# EAGLE schematic avalon_module (EAGLE 6.2)
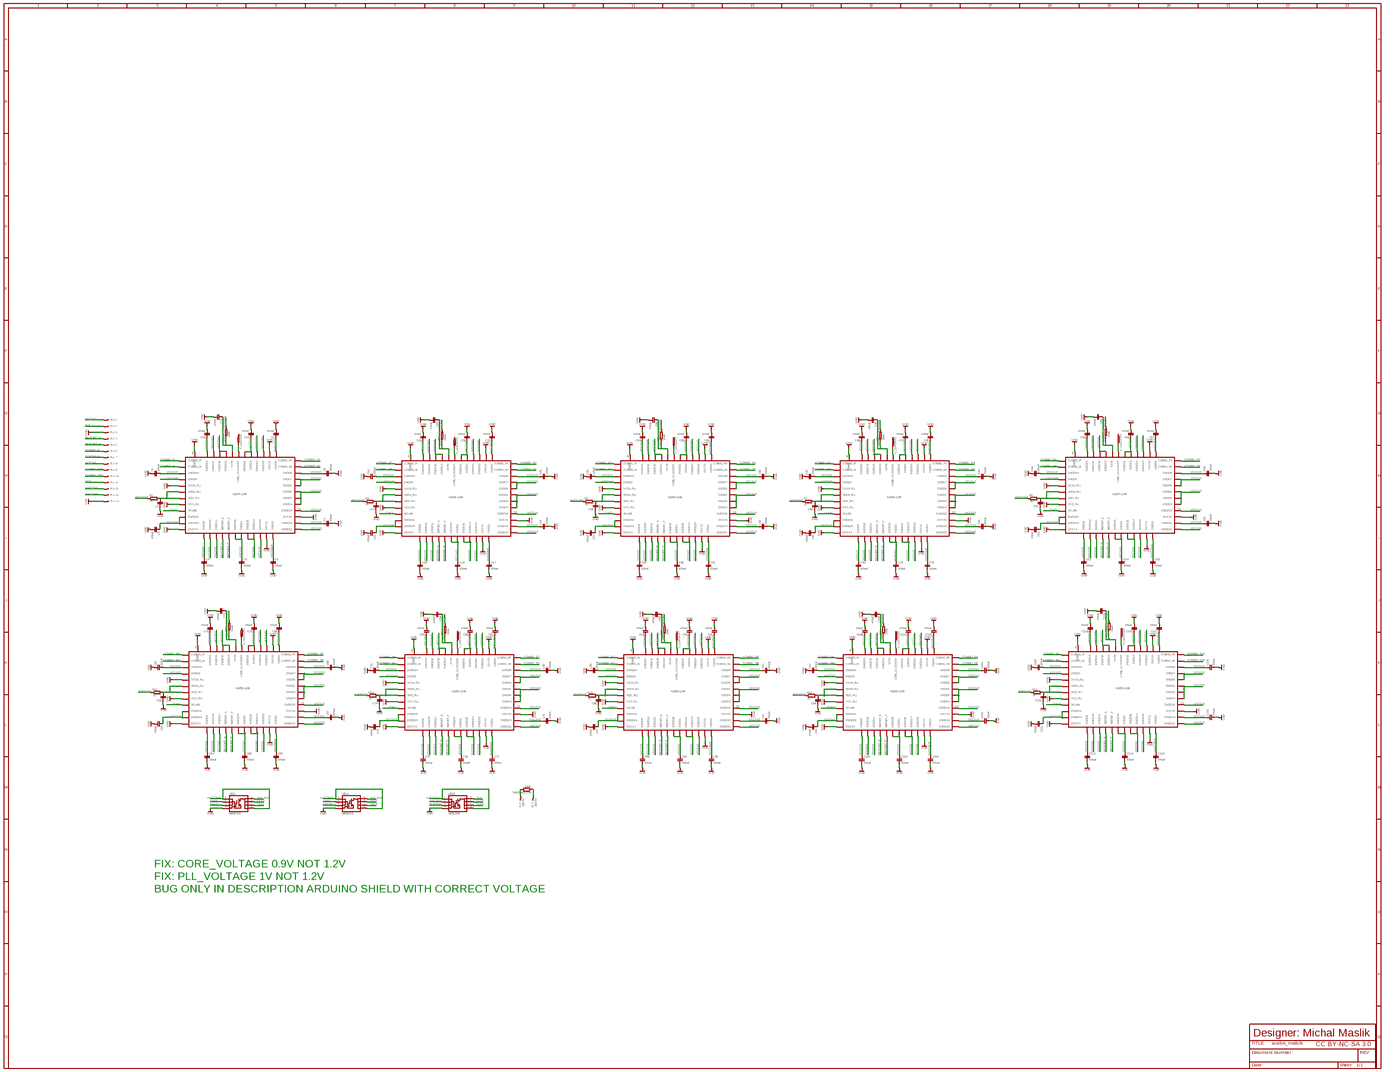
[diagram p0: schematic, sheet 1, overview]
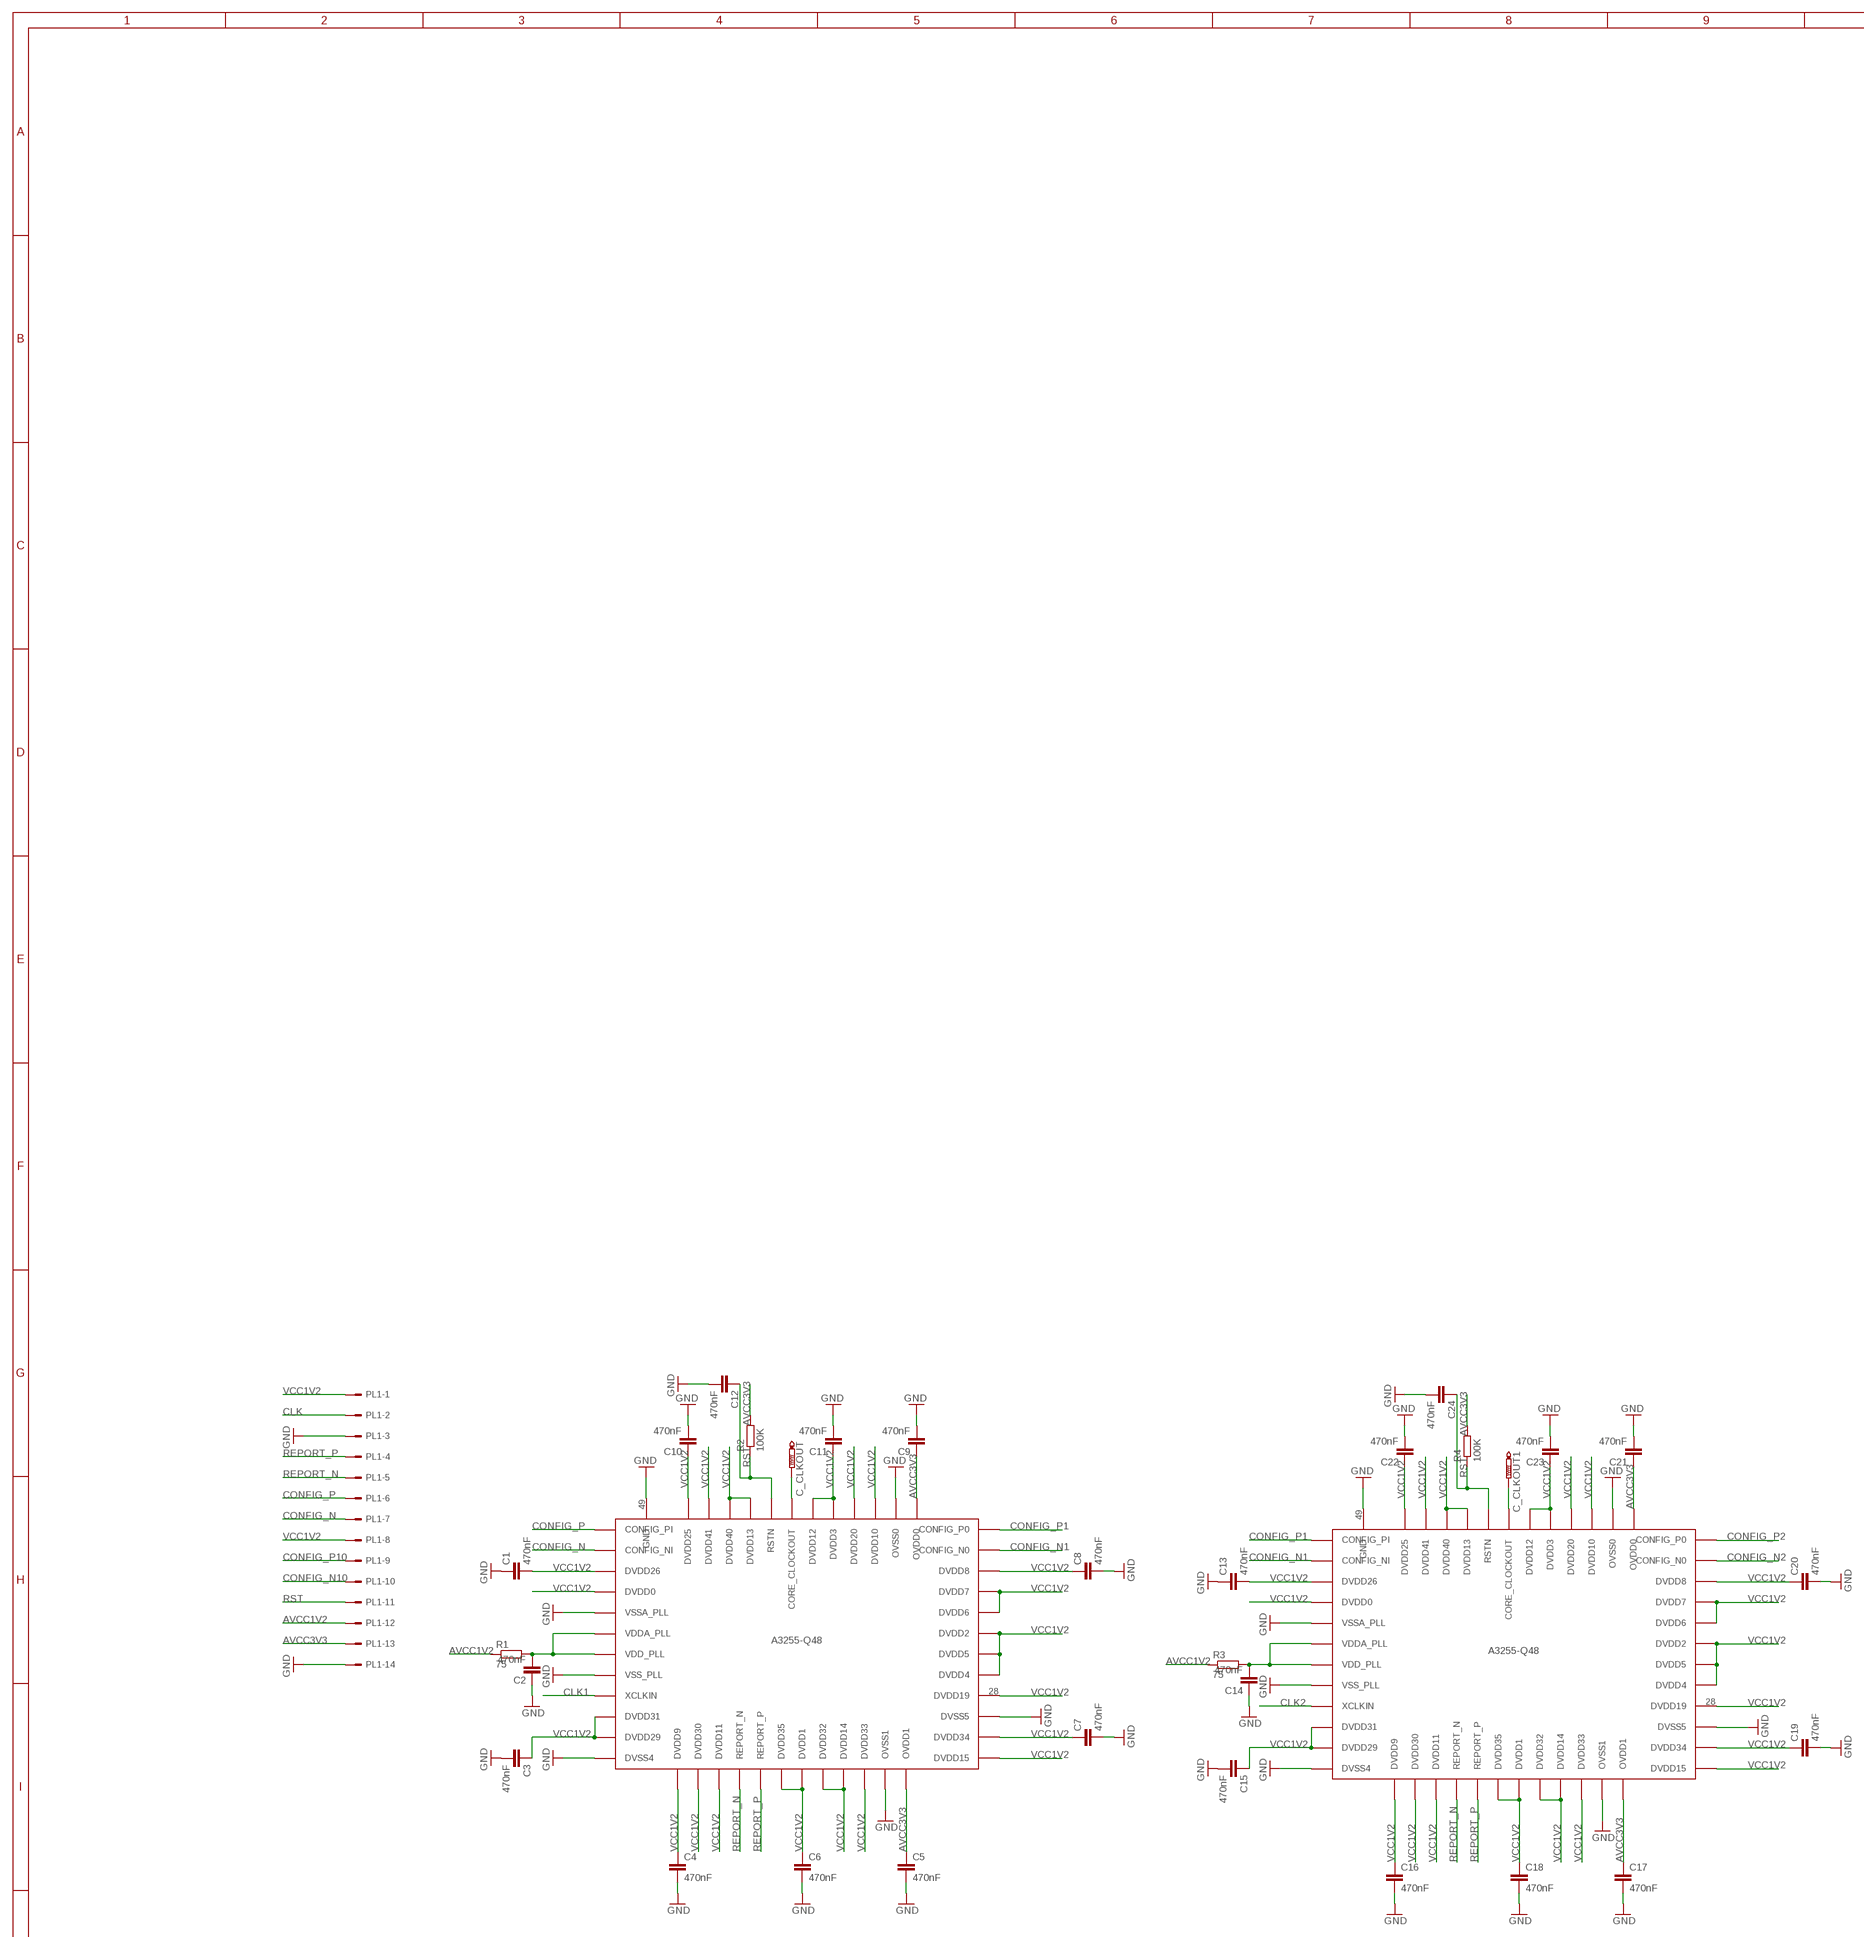
[diagram p1: schematic, sheet 1, part 1 of 6]
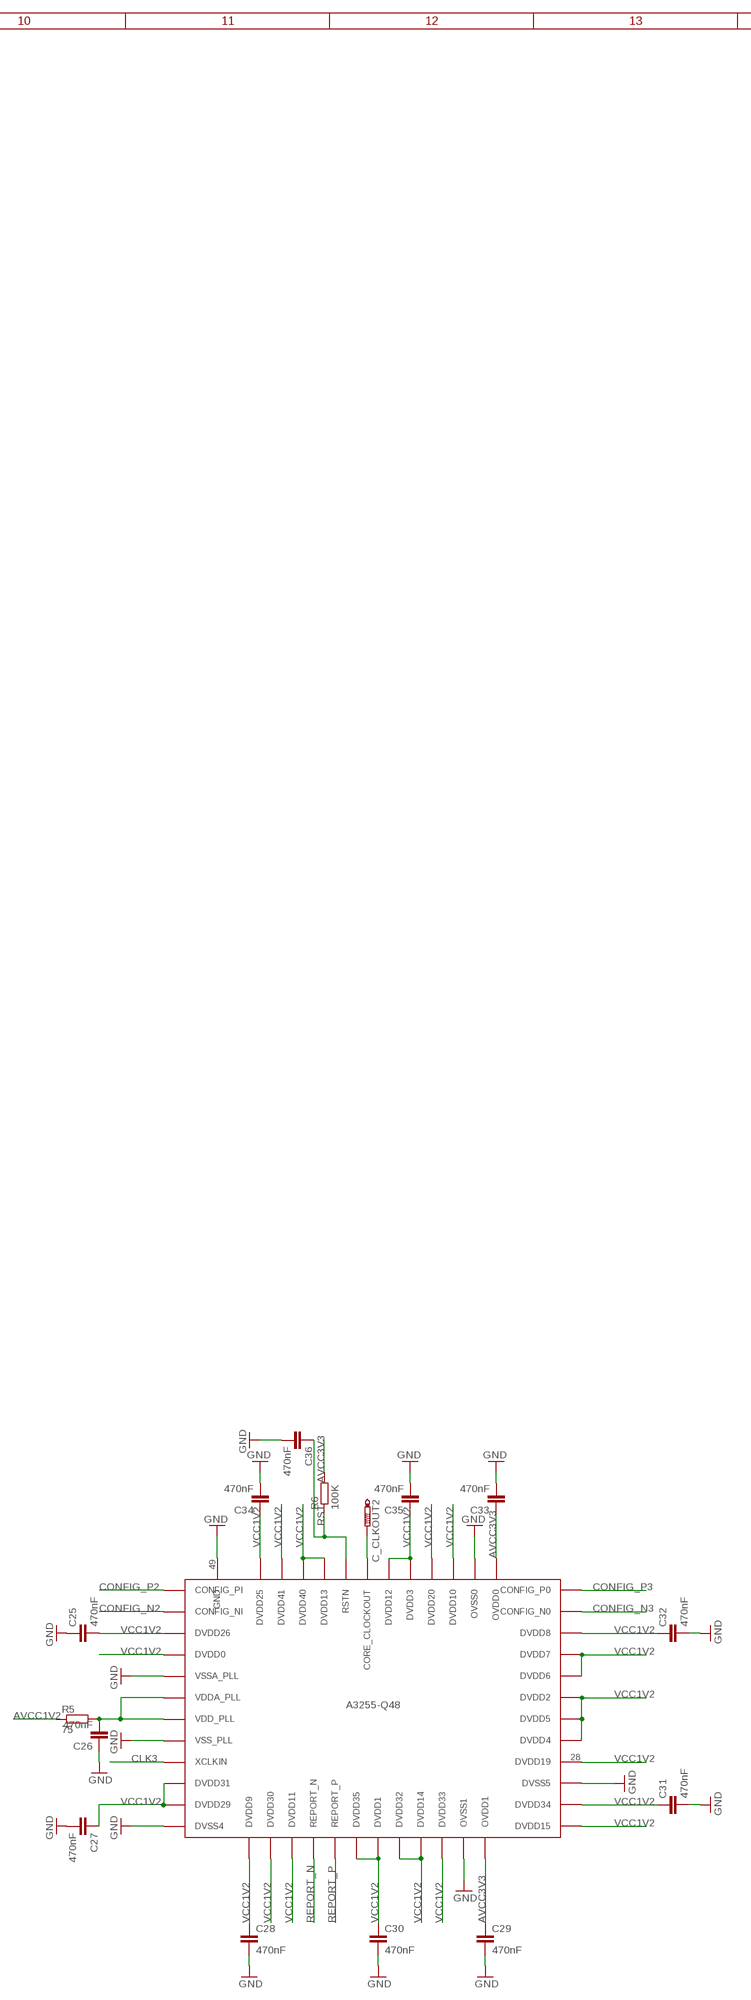
[diagram p2: schematic, sheet 1, part 2 of 6]
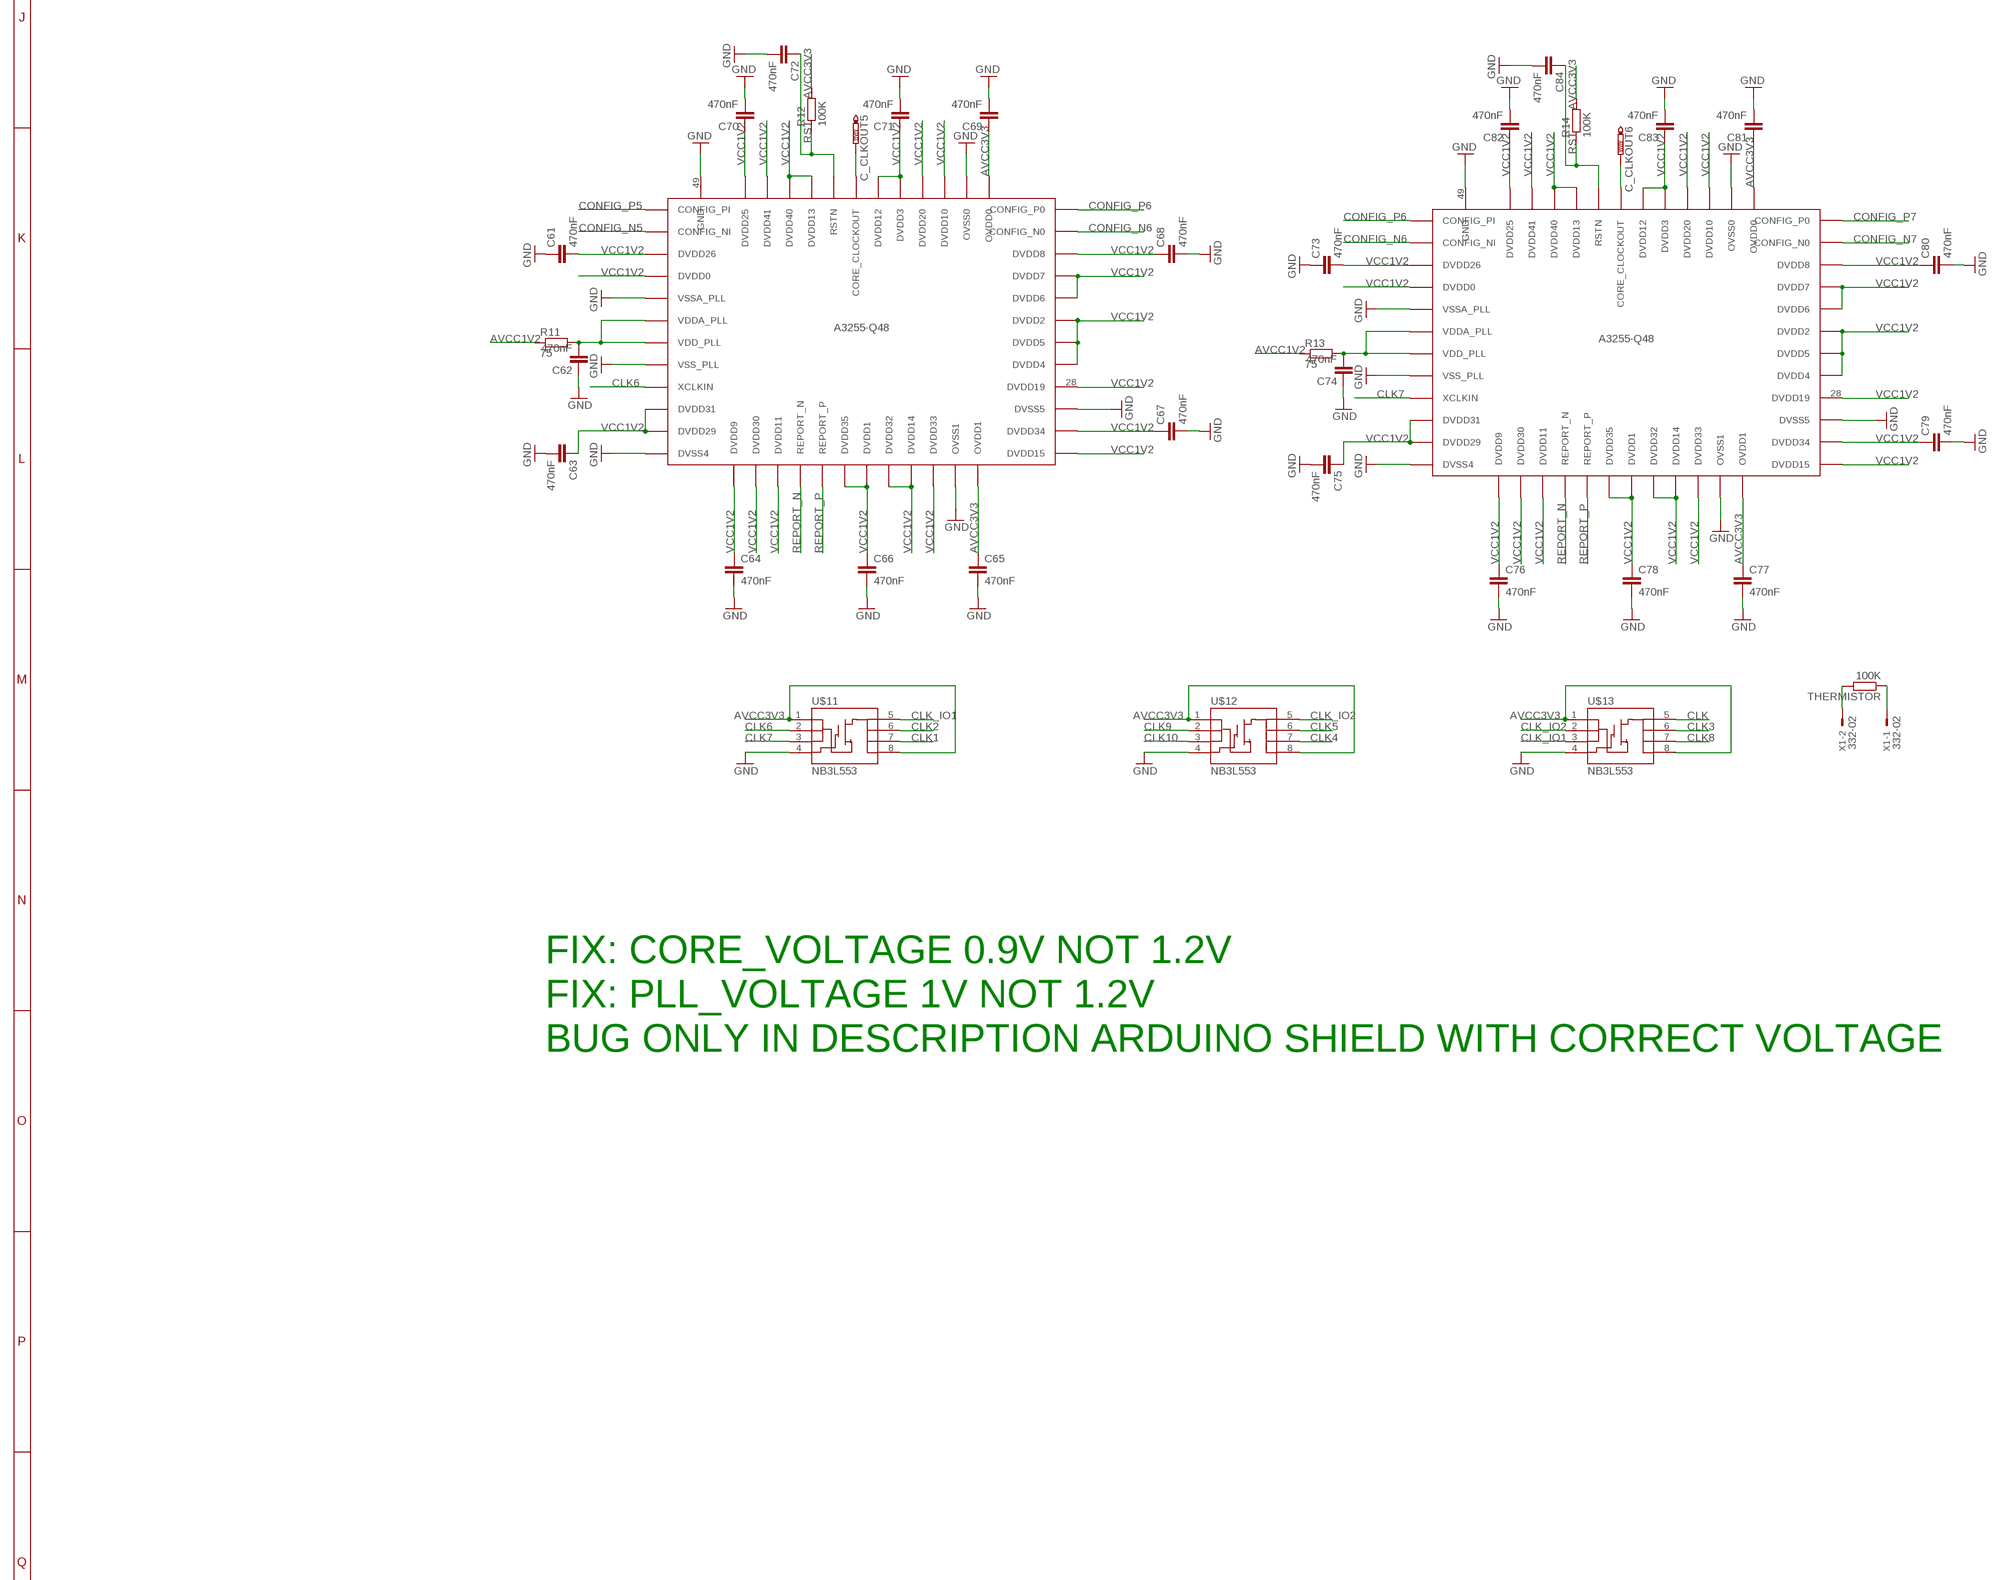
[diagram p3: schematic, sheet 1, part 3 of 6]
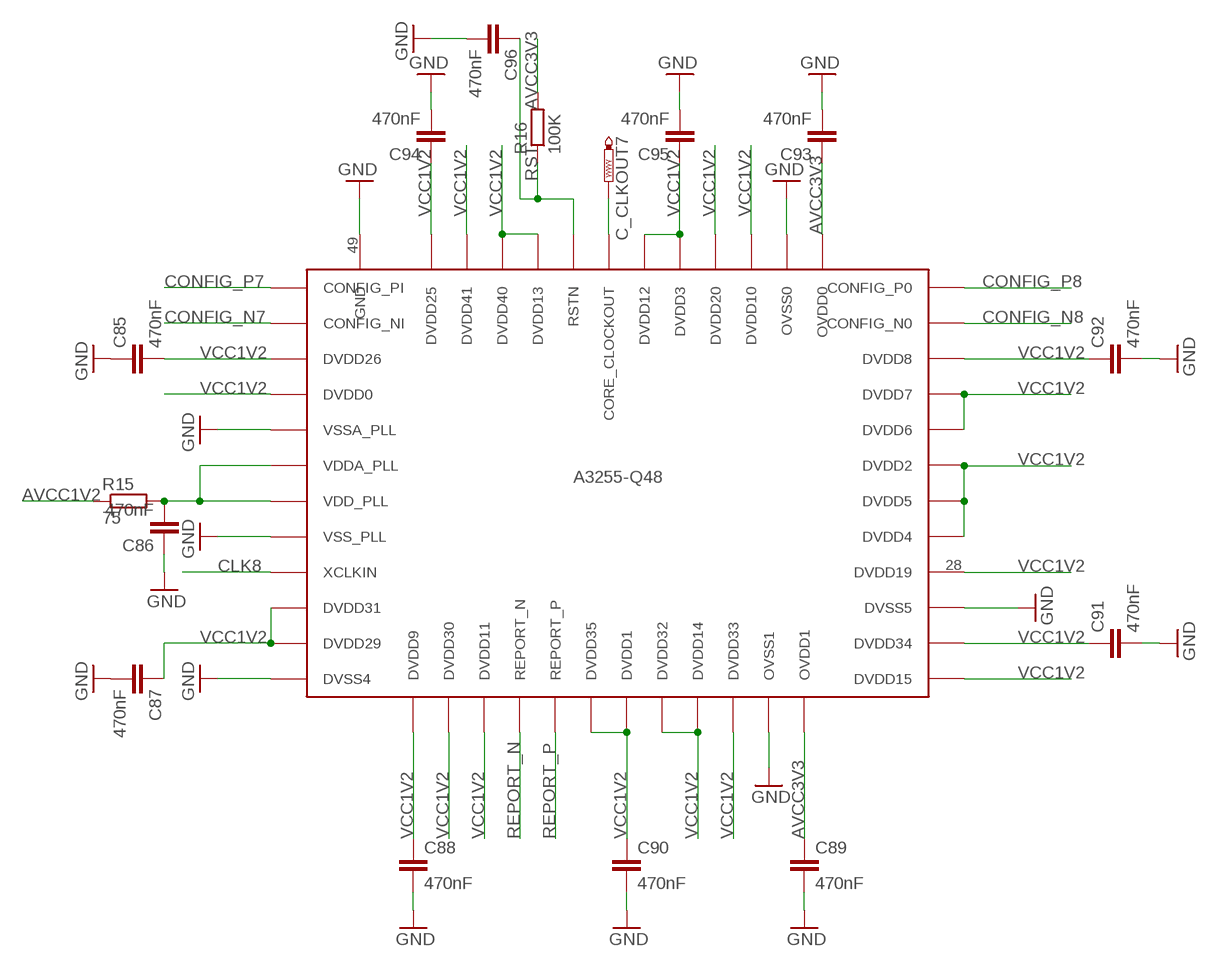
[diagram p4: schematic, sheet 1, part 4 of 6]
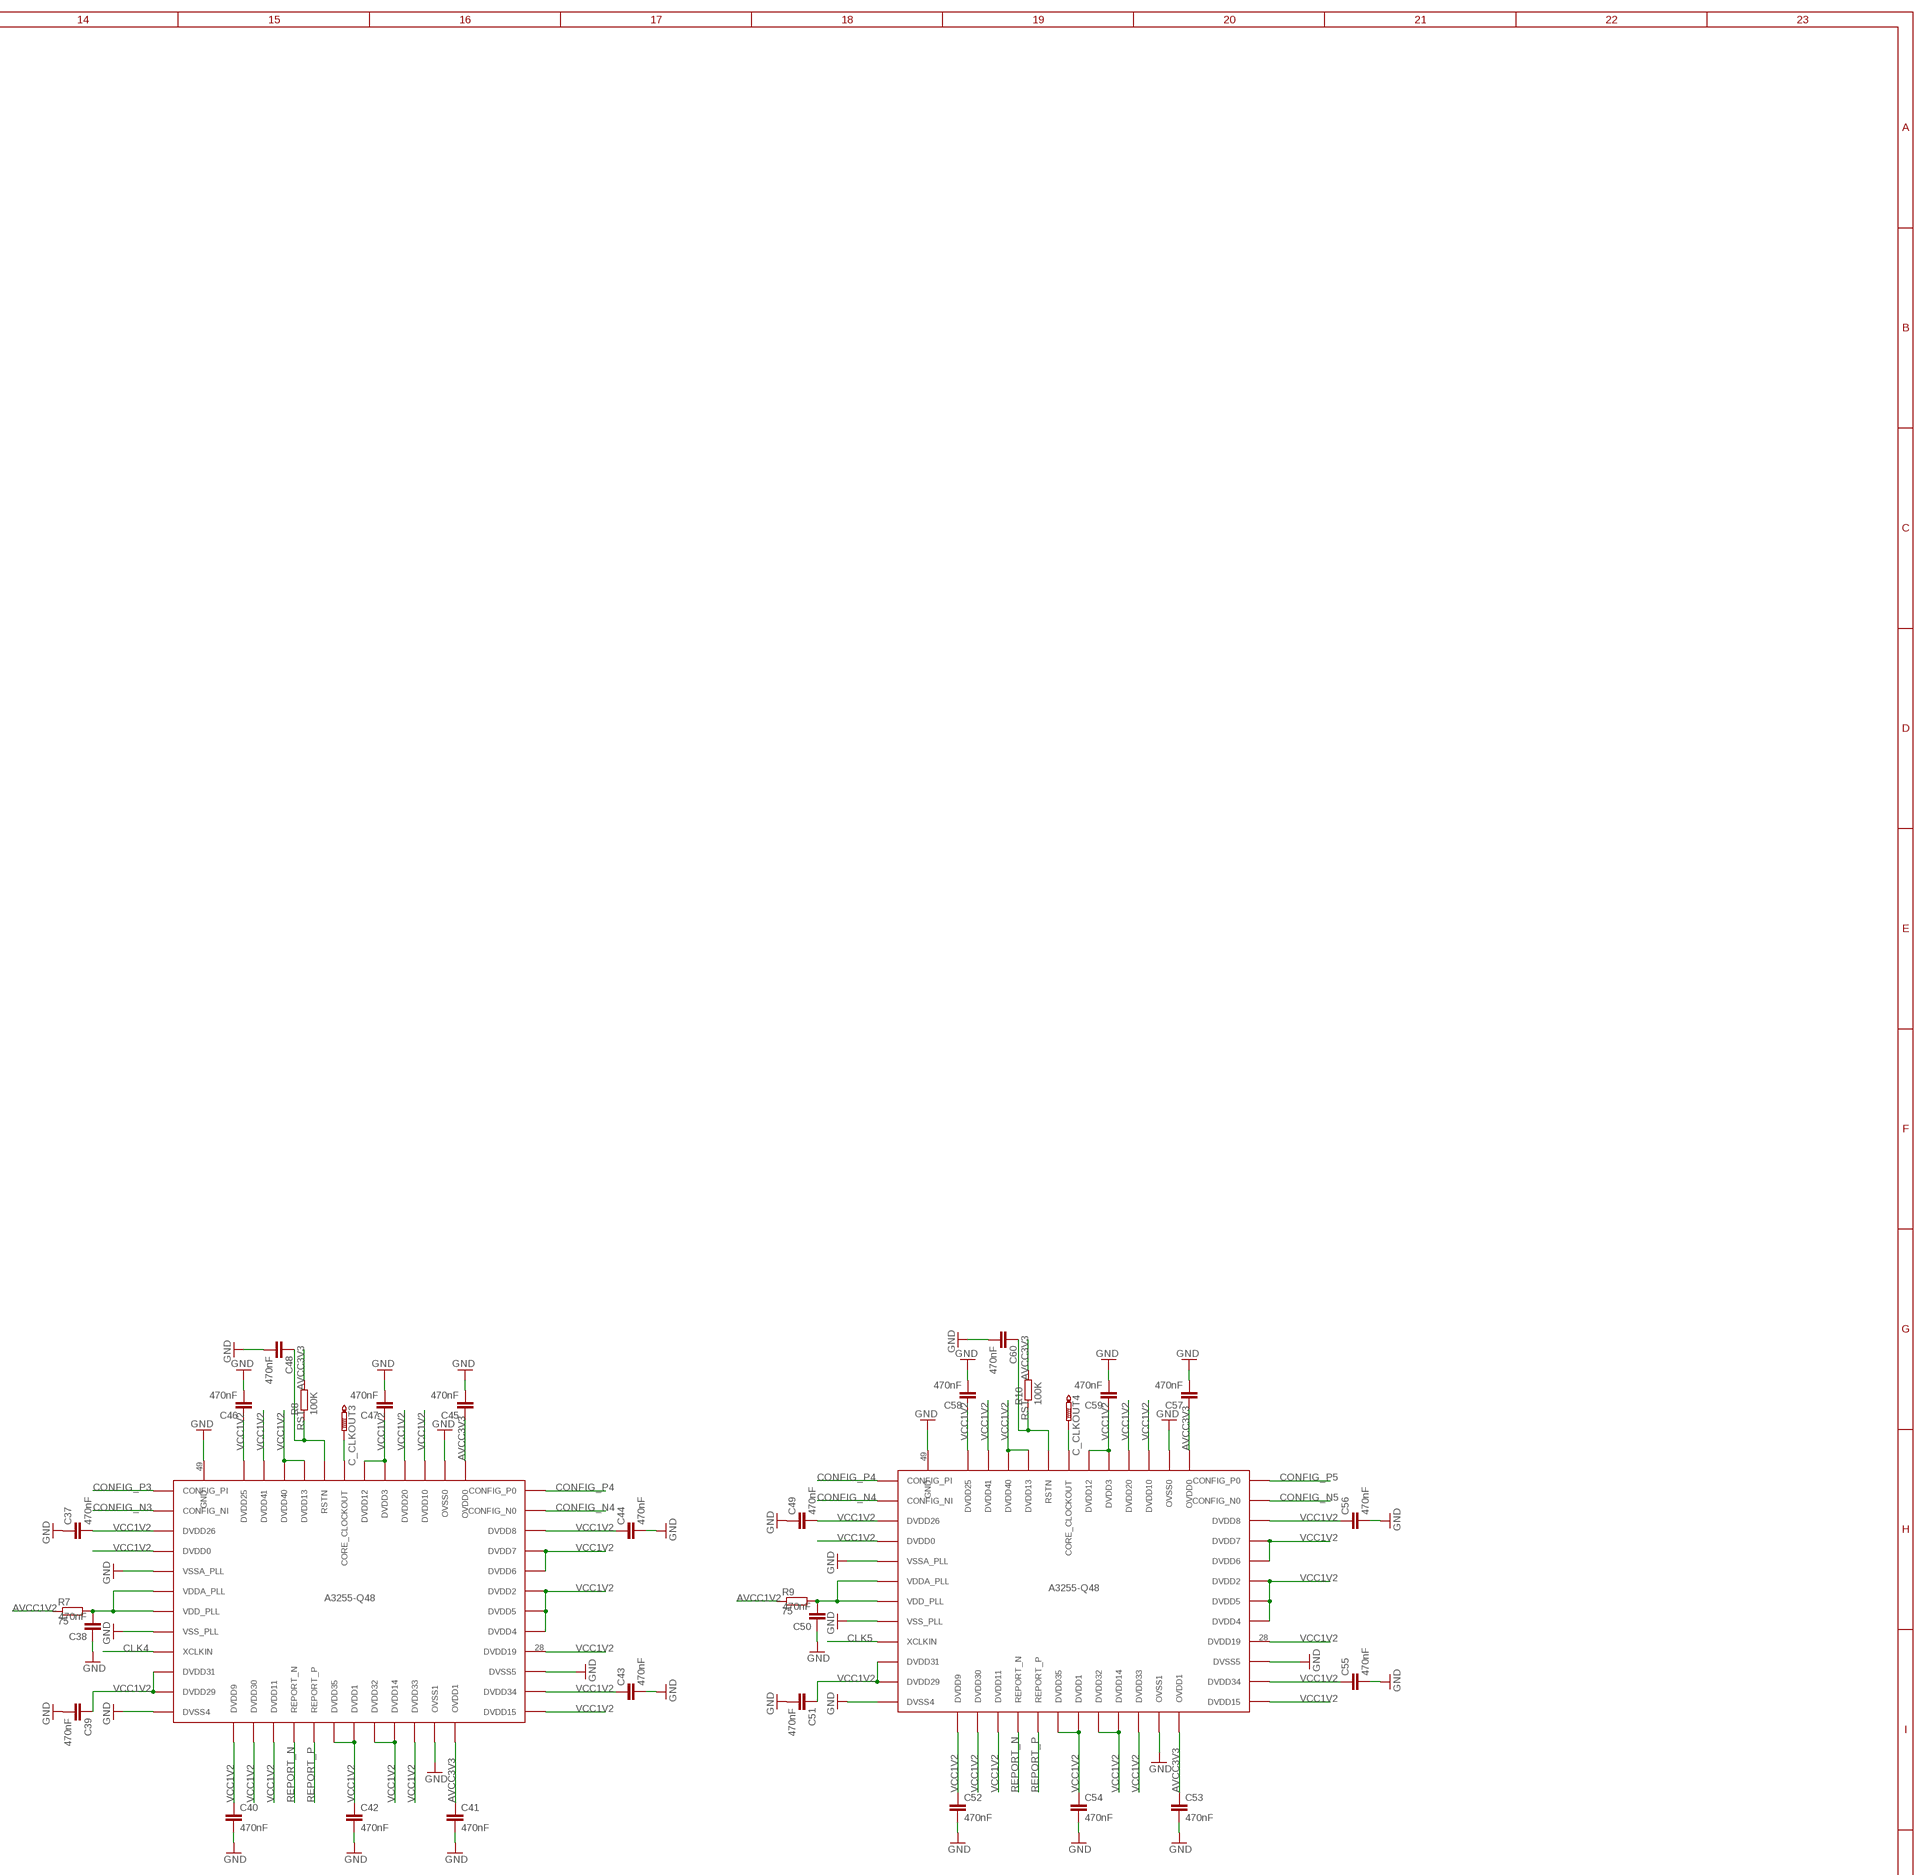
[diagram p5: schematic, sheet 1, part 5 of 6]
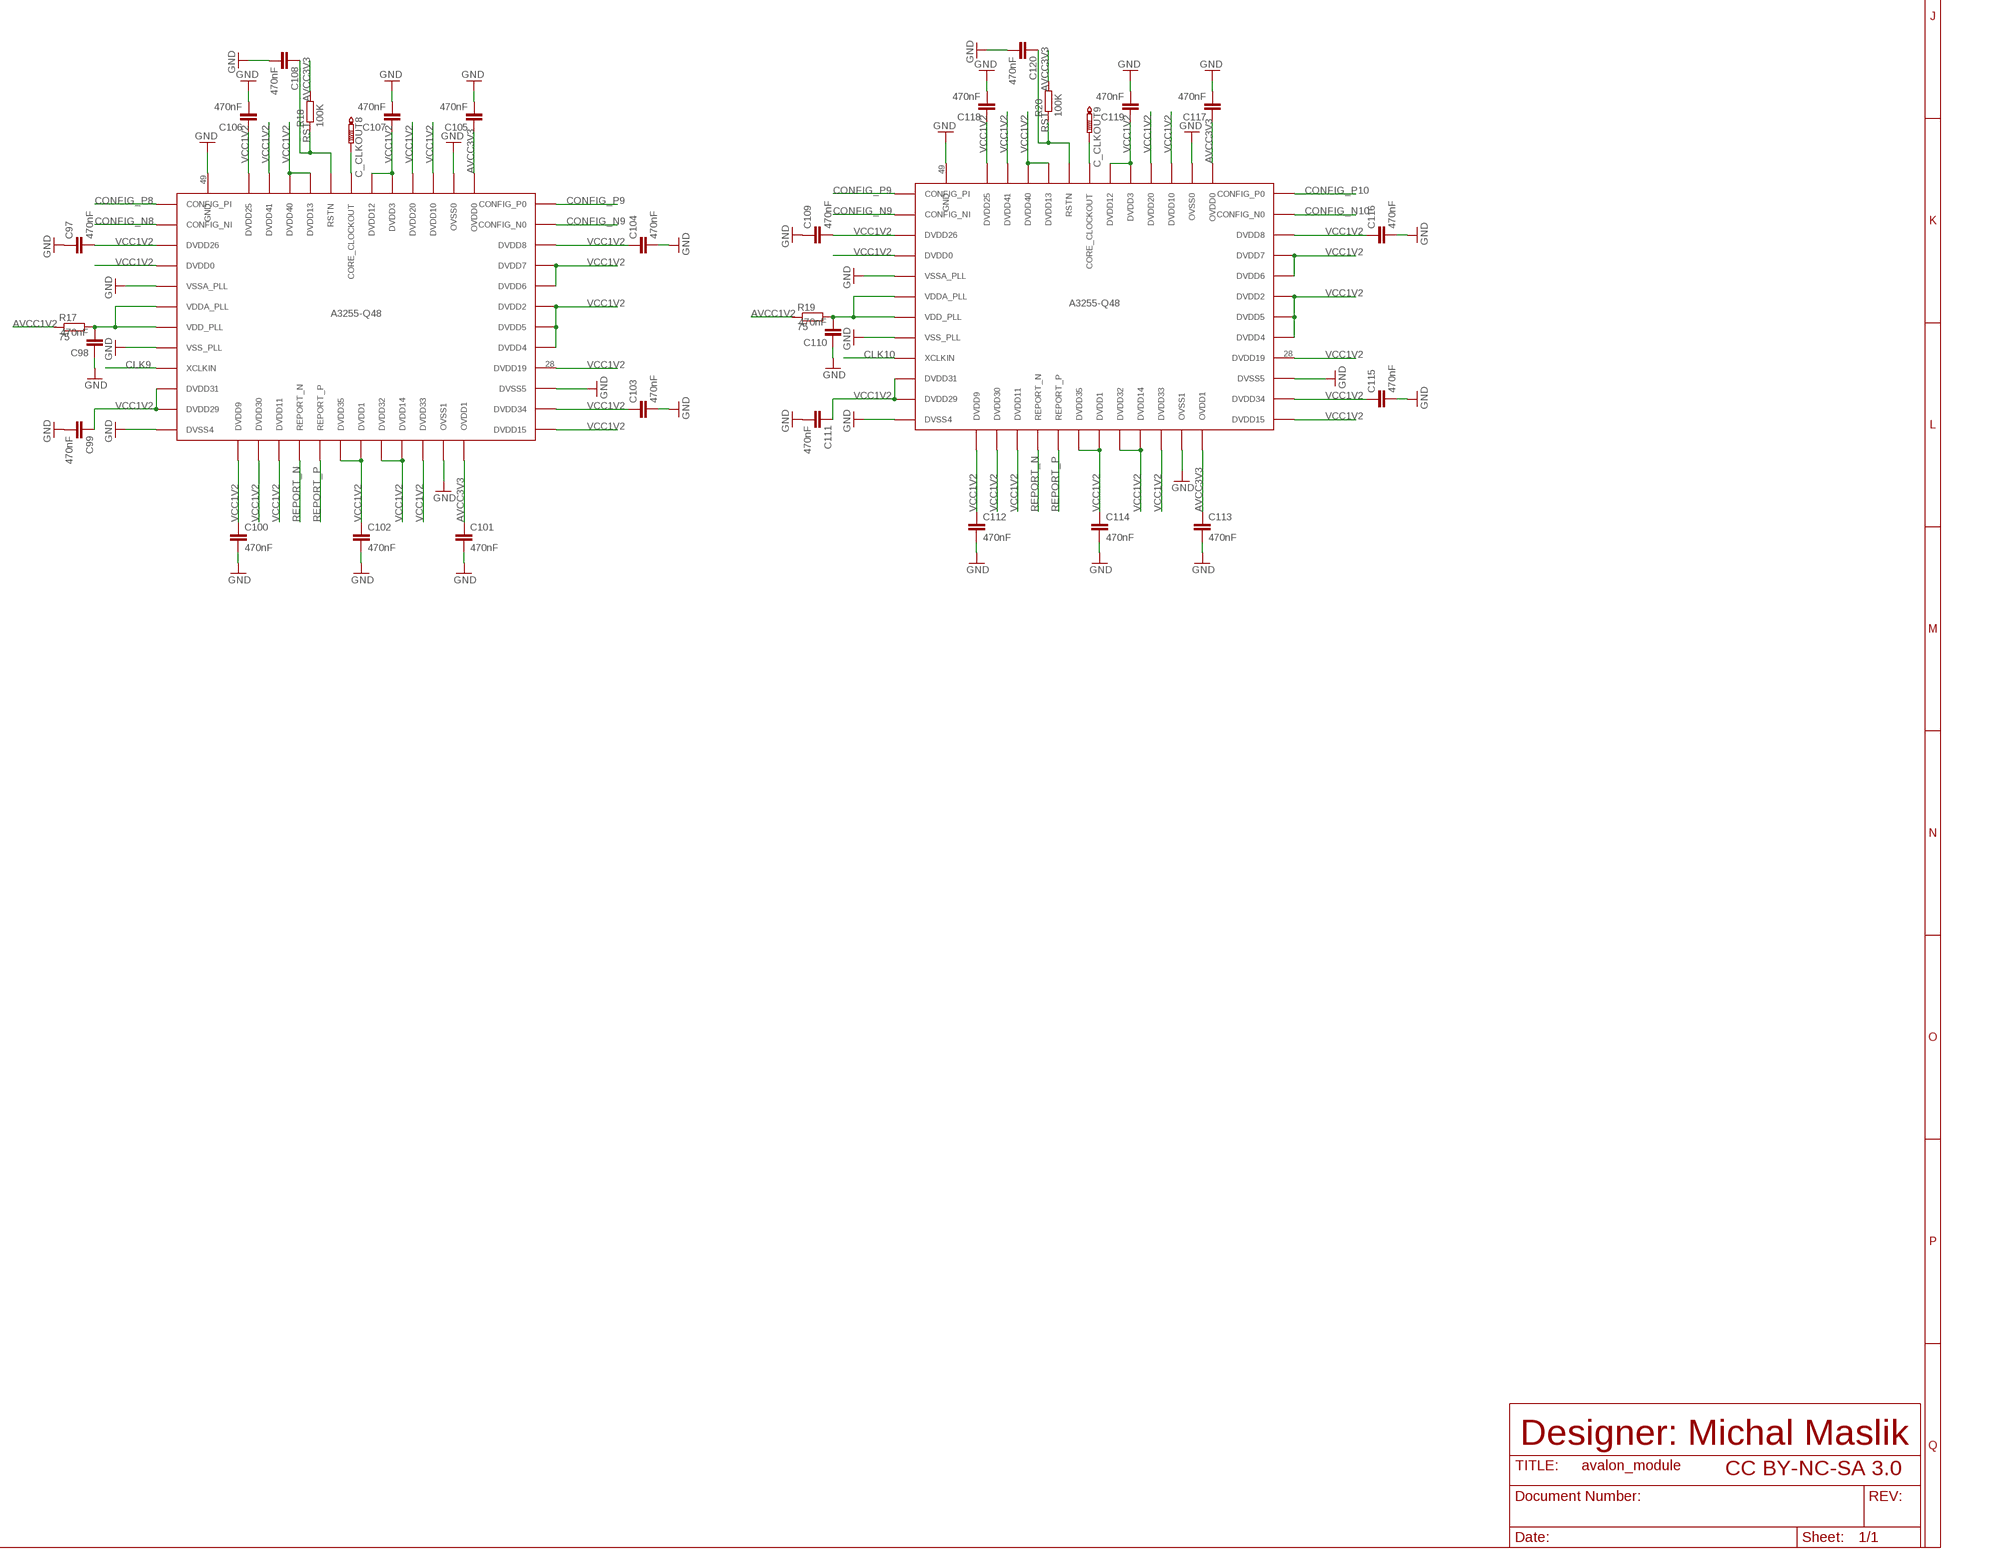
[diagram p6: schematic, sheet 1, part 6 of 6]

## Parts
C1  470nF  C-EUC0603K  [C0603K]
C2  470nF  C-EUC0603K  [C0603K]
C3  470nF  C-EUC0603K  [C0603K]
C4  470nF  C-EUC0603K  [C0603K]
C5  470nF  C-EUC0603K  [C0603K]
C6  470nF  C-EUC0603K  [C0603K]
C7  470nF  C-EUC0603K  [C0603K]
C8  470nF  C-EUC0603K  [C0603K]
C9  470nF  C-EUC0603K  [C0603K]
C10  470nF  C-EUC0603K  [C0603K]
C11  470nF  C-EUC0603K  [C0603K]
C12  470nF  C-EUC0603K  [C0603K]
C13  470nF  C-EUC0603K  [C0603K]
C14  470nF  C-EUC0603K  [C0603K]
C15  470nF  C-EUC0603K  [C0603K]
C16  470nF  C-EUC0603K  [C0603K]
C17  470nF  C-EUC0603K  [C0603K]
C18  470nF  C-EUC0603K  [C0603K]
C19  470nF  C-EUC0603K  [C0603K]
C20  470nF  C-EUC0603K  [C0603K]
C21  470nF  C-EUC0603K  [C0603K]
C22  470nF  C-EUC0603K  [C0603K]
C23  470nF  C-EUC0603K  [C0603K]
C24  470nF  C-EUC0603K  [C0603K]
C25  470nF  C-EUC0603K  [C0603K]
C26  470nF  C-EUC0603K  [C0603K]
C27  470nF  C-EUC0603K  [C0603K]
C28  470nF  C-EUC0603K  [C0603K]
C29  470nF  C-EUC0603K  [C0603K]
C30  470nF  C-EUC0603K  [C0603K]
C31  470nF  C-EUC0603K  [C0603K]
C32  470nF  C-EUC0603K  [C0603K]
C33  470nF  C-EUC0603K  [C0603K]
C34  470nF  C-EUC0603K  [C0603K]
C35  470nF  C-EUC0603K  [C0603K]
C36  470nF  C-EUC0603K  [C0603K]
C37  470nF  C-EUC0603K  [C0603K]
C38  470nF  C-EUC0603K  [C0603K]
C39  470nF  C-EUC0603K  [C0603K]
C40  470nF  C-EUC0603K  [C0603K]
C41  470nF  C-EUC0603K  [C0603K]
C42  470nF  C-EUC0603K  [C0603K]
C43  470nF  C-EUC0603K  [C0603K]
C44  470nF  C-EUC0603K  [C0603K]
C45  470nF  C-EUC0603K  [C0603K]
C46  470nF  C-EUC0603K  [C0603K]
C47  470nF  C-EUC0603K  [C0603K]
C48  470nF  C-EUC0603K  [C0603K]
C49  470nF  C-EUC0603K  [C0603K]
C50  470nF  C-EUC0603K  [C0603K]
C51  470nF  C-EUC0603K  [C0603K]
C52  470nF  C-EUC0603K  [C0603K]
C53  470nF  C-EUC0603K  [C0603K]
C54  470nF  C-EUC0603K  [C0603K]
C55  470nF  C-EUC0603K  [C0603K]
C56  470nF  C-EUC0603K  [C0603K]
C57  470nF  C-EUC0603K  [C0603K]
C58  470nF  C-EUC0603K  [C0603K]
C59  470nF  C-EUC0603K  [C0603K]
C60  470nF  C-EUC0603K  [C0603K]
C61  470nF  C-EUC0603K  [C0603K]
C62  470nF  C-EUC0603K  [C0603K]
C63  470nF  C-EUC0603K  [C0603K]
C64  470nF  C-EUC0603K  [C0603K]
C65  470nF  C-EUC0603K  [C0603K]
C66  470nF  C-EUC0603K  [C0603K]
C67  470nF  C-EUC0603K  [C0603K]
C68  470nF  C-EUC0603K  [C0603K]
C69  470nF  C-EUC0603K  [C0603K]
C70  470nF  C-EUC0603K  [C0603K]
C71  470nF  C-EUC0603K  [C0603K]
C72  470nF  C-EUC0603K  [C0603K]
C73  470nF  C-EUC0603K  [C0603K]
C74  470nF  C-EUC0603K  [C0603K]
C75  470nF  C-EUC0603K  [C0603K]
C76  470nF  C-EUC0603K  [C0603K]
C77  470nF  C-EUC0603K  [C0603K]
C78  470nF  C-EUC0603K  [C0603K]
C79  470nF  C-EUC0603K  [C0603K]
C80  470nF  C-EUC0603K  [C0603K]
C81  470nF  C-EUC0603K  [C0603K]
C82  470nF  C-EUC0603K  [C0603K]
C83  470nF  C-EUC0603K  [C0603K]
C84  470nF  C-EUC0603K  [C0603K]
C85  470nF  C-EUC0603K  [C0603K]
C86  470nF  C-EUC0603K  [C0603K]
C87  470nF  C-EUC0603K  [C0603K]
C88  470nF  C-EUC0603K  [C0603K]
C89  470nF  C-EUC0603K  [C0603K]
C90  470nF  C-EUC0603K  [C0603K]
C91  470nF  C-EUC0603K  [C0603K]
C92  470nF  C-EUC0603K  [C0603K]
C93  470nF  C-EUC0603K  [C0603K]
C94  470nF  C-EUC0603K  [C0603K]
C95  470nF  C-EUC0603K  [C0603K]
C96  470nF  C-EUC0603K  [C0603K]
C97  470nF  C-EUC0603K  [C0603K]
C98  470nF  C-EUC0603K  [C0603K]
C99  470nF  C-EUC0603K  [C0603K]
C100  470nF  C-EUC0603K  [C0603K]
C101  470nF  C-EUC0603K  [C0603K]
C102  470nF  C-EUC0603K  [C0603K]
C103  470nF  C-EUC0603K  [C0603K]
C104  470nF  C-EUC0603K  [C0603K]
C105  470nF  C-EUC0603K  [C0603K]
C106  470nF  C-EUC0603K  [C0603K]
C107  470nF  C-EUC0603K  [C0603K]
C108  470nF  C-EUC0603K  [C0603K]
C109  470nF  C-EUC0603K  [C0603K]
C110  470nF  C-EUC0603K  [C0603K]
C111  470nF  C-EUC0603K  [C0603K]
C112  470nF  C-EUC0603K  [C0603K]
C113  470nF  C-EUC0603K  [C0603K]
C114  470nF  C-EUC0603K  [C0603K]
C115  470nF  C-EUC0603K  [C0603K]
C116  470nF  C-EUC0603K  [C0603K]
C117  470nF  C-EUC0603K  [C0603K]
C118  470nF  C-EUC0603K  [C0603K]
C119  470nF  C-EUC0603K  [C0603K]
C120  470nF  C-EUC0603K  [C0603K]
C_CLKOUT  PTR1TP07R  [TP07R]
C_CLKOUT1  PTR1TP07R  [TP07R]
C_CLKOUT2  PTR1TP07R  [TP07R]
C_CLKOUT3  PTR1TP07R  [TP07R]
C_CLKOUT4  PTR1TP07R  [TP07R]
C_CLKOUT5  PTR1TP07R  [TP07R]
C_CLKOUT6  PTR1TP07R  [TP07R]
C_CLKOUT7  PTR1TP07R  [TP07R]
C_CLKOUT8  PTR1TP07R  [TP07R]
C_CLKOUT9  PTR1TP07R  [TP07R]
PL1  555X-14H  [5569-14]
R1  75  R-EU_R0603  [R0603]
R2  100K  R-EU_R0603  [R0603]
R3  75  R-EU_R0603  [R0603]
R4  100K  R-EU_R0603  [R0603]
R5  75  R-EU_R0603  [R0603]
R6  100K  R-EU_R0603  [R0603]
R7  75  R-EU_R0603  [R0603]
R8  100K  R-EU_R0603  [R0603]
R9  75  R-EU_R0603  [R0603]
R10  100K  R-EU_R0603  [R0603]
R11  75  R-EU_R0603  [R0603]
R12  100K  R-EU_R0603  [R0603]
R13  75  R-EU_R0603  [R0603]
R14  100K  R-EU_R0603  [R0603]
R15  75  R-EU_R0603  [R0603]
R16  100K  R-EU_R0603  [R0603]
R17  75  R-EU_R0603  [R0603]
R18  100K  R-EU_R0603  [R0603]
R19  75  R-EU_R0603  [R0603]
R20  100K  R-EU_R0603  [R0603]
THERMISTOR  100K  R-EU_R0603  [R0603]
U$1  A3255Q48  [A3255Q48]
U$2  A3255Q48  [A3255Q48]
U$3  A3255Q48  [A3255Q48]
U$4  A3255Q48  [A3255Q48]
U$5  A3255Q48  [A3255Q48]
U$6  A3255Q48  [A3255Q48]
U$7  A3255Q48  [A3255Q48]
U$8  A3255Q48  [A3255Q48]
U$9  A3255Q48  [A3255Q48]
U$10  A3255Q48  [A3255Q48]
U$11  NB3L553  MOSFET-NCHANNEL-SOIC8  [SO08]
U$12  NB3L553  MOSFET-NCHANNEL-SOIC8  [SO08]
U$13  NB3L553  MOSFET-NCHANNEL-SOIC8  [SO08]
X1  332-02  [332-02]

## Nets
$1: C14.2 R3.2 U$2.6(VDDA_PLL) U$2.7(VDD_PLL)
$2: C26.2 R5.2 U$3.6(VDDA_PLL) U$3.7(VDD_PLL)
$3: C2.2 R1.2 U$1.6(VDDA_PLL) U$1.7(VDD_PLL)
$4: C38.2 R7.2 U$4.6(VDDA_PLL) U$4.7(VDD_PLL)
$5: C50.2 R9.2 U$5.6(VDDA_PLL) U$5.7(VDD_PLL)
$6: C62.2 R11.2 U$6.6(VDDA_PLL) U$6.7(VDD_PLL)
$7: C74.2 R13.2 U$7.6(VDDA_PLL) U$7.7(VDD_PLL)
$8: C86.2 R15.2 U$8.6(VDDA_PLL) U$8.7(VDD_PLL)
$9: C98.2 R17.2 U$9.6(VDDA_PLL) U$9.7(VDD_PLL)
$10: C110.2 R19.2 U$10.6(VDDA_PLL) U$10.7(VDD_PLL)
AVCC1V2: PL1.12 R1.1 R3.1 R5.1 R7.1 R9.1 R11.1 R13.1 R15.1 R17.1 R19.1
AVCC3V3: C5.1 C9.1 C17.1 C21.1 C29.1 C33.1 C41.1 C45.1 C53.1 C57.1 C65.1 C69.1 C77.1 C81.1 C89.1 C93.1 C101.1 C105.1 C113.1 C117.1 PL1.13 R2.2 R4.2 R6.2 R8.2 R10.2 R12.2 R14.2 R16.2 R18.2 R20.2 U$1.24(OVDD1) U$1.37(OVDD0) U$2.24(OVDD1) U$2.37(OVDD0) U$3.24(OVDD1) U$3.37(OVDD0) U$4.24(OVDD1) U$4.37(OVDD0) U$5.24(OVDD1) U$5.37(OVDD0) U$6.24(OVDD1) U$6.37(OVDD0) U$7.24(OVDD1) U$7.37(OVDD0) U$8.24(OVDD1) U$8.37(OVDD0) U$9.24(OVDD1) U$9.37(OVDD0) U$10.24(OVDD1) U$10.37(OVDD0) U$11.1(S) U$11.8(D) U$12.1(S) U$12.8(D) U$13.1(S) U$13.8(D)
CLK: PL1.2 U$13.5(D)
CLK1: U$1.9(XCLKIN) U$11.7(D)
CLK2: U$2.9(XCLKIN) U$11.6(D)
CLK3: U$3.9(XCLKIN) U$13.6(D)
CLK4: U$4.9(XCLKIN) U$12.7(D)
CLK5: U$5.9(XCLKIN) U$12.6(D)
CLK6: U$6.9(XCLKIN) U$11.2(S)
CLK7: U$7.9(XCLKIN) U$11.3(S)
CLK8: U$8.9(XCLKIN) U$13.7(D)
CLK9: U$9.9(XCLKIN) U$12.2(S)
CLK10: U$10.9(XCLKIN) U$12.3(S)
CLK_IO1: U$11.5(D) U$13.3(S)
CLK_IO2: U$12.5(D) U$13.2(S)
CONFIG_N: PL1.7 U$1.2(CONFIG_NI)
CONFIG_N1: U$1.35(CONFIG_N0) U$2.2(CONFIG_NI)
CONFIG_N2: U$2.35(CONFIG_N0) U$3.2(CONFIG_NI)
CONFIG_N3: U$3.35(CONFIG_N0) U$4.2(CONFIG_NI)
CONFIG_N4: U$4.35(CONFIG_N0) U$5.2(CONFIG_NI)
CONFIG_N5: U$5.35(CONFIG_N0) U$6.2(CONFIG_NI)
CONFIG_N6: U$6.35(CONFIG_N0) U$7.2(CONFIG_NI)
CONFIG_N7: U$7.35(CONFIG_N0) U$8.2(CONFIG_NI)
CONFIG_N8: U$8.35(CONFIG_N0) U$9.2(CONFIG_NI)
CONFIG_N9: U$9.35(CONFIG_N0) U$10.2(CONFIG_NI)
CONFIG_N10: PL1.10 U$10.35(CONFIG_N0)
CONFIG_P: PL1.6 U$1.1(CONFIG_PI)
CONFIG_P1: U$1.36(CONFIG_P0) U$2.1(CONFIG_PI)
CONFIG_P2: U$2.36(CONFIG_P0) U$3.1(CONFIG_PI)
CONFIG_P3: U$3.36(CONFIG_P0) U$4.1(CONFIG_PI)
CONFIG_P4: U$4.36(CONFIG_P0) U$5.1(CONFIG_PI)
CONFIG_P5: U$5.36(CONFIG_P0) U$6.1(CONFIG_PI)
CONFIG_P6: U$6.36(CONFIG_P0) U$7.1(CONFIG_PI)
CONFIG_P7: U$7.36(CONFIG_P0) U$8.1(CONFIG_PI)
CONFIG_P8: U$8.36(CONFIG_P0) U$9.1(CONFIG_PI)
CONFIG_P9: U$9.36(CONFIG_P0) U$10.1(CONFIG_PI)
CONFIG_P10: PL1.9 U$10.36(CONFIG_P0)
GND: C1.1 C2.1 C3.2 C4.2 C5.2 C6.2 C7.2 C8.2 C9.2 C10.2 C11.2 C12.2 C13.1 C14.1 C15.2 C16.2 C17.2 C18.2 C19.2 C20.2 C21.2 C22.2 C23.2 C24.2 C25.1 C26.1 C27.2 C28.2 C29.2 C30.2 C31.2 C32.2 C33.2 C34.2 C35.2 C36.2 C37.1 C38.1 C39.2 C40.2 C41.2 C42.2 C43.2 C44.2 C45.2 C46.2 C47.2 C48.2 C49.1 C50.1 C51.2 C52.2 C53.2 C54.2 C55.2 C56.2 C57.2 C58.2 C59.2 C60.2 C61.1 C62.1 C63.2 C64.2 C65.2 C66.2 C67.2 C68.2 C69.2 C70.2 C71.2 C72.2 C73.1 C74.1 C75.2 C76.2 C77.2 C78.2 C79.2 C80.2 C81.2 C82.2 C83.2 C84.2 C85.1 C86.1 C87.2 C88.2 C89.2 C90.2 C91.2 C92.2 C93.2 C94.2 C95.2 C96.2 C97.1 C98.1 C99.2 C100.2 C101.2 C102.2 C103.2 C104.2 C105.2 C106.2 C107.2 C108.2 C109.1 C110.1 C111.2 C112.2 C113.2 C114.2 C115.2 C116.2 C117.2 C118.2 C119.2 C120.2 PL1.3 PL1.14 U$1.5(VSSA_PLL) U$1.8(VSS_PLL) U$1.12(DVSS4) U$1.23(OVSS1) U$1.27(DVSS5) U$1.38(OVSS0) U$1.49(GND) U$2.5(VSSA_PLL) U$2.8(VSS_PLL) U$2.12(DVSS4) U$2.23(OVSS1) U$2.27(DVSS5) U$2.38(OVSS0) U$2.49(GND) U$3.5(VSSA_PLL) U$3.8(VSS_PLL) U$3.12(DVSS4) U$3.23(OVSS1) U$3.27(DVSS5) U$3.38(OVSS0) U$3.49(GND) U$4.5(VSSA_PLL) U$4.8(VSS_PLL) U$4.12(DVSS4) U$4.23(OVSS1) U$4.27(DVSS5) U$4.38(OVSS0) U$4.49(GND) U$5.5(VSSA_PLL) U$5.8(VSS_PLL) U$5.12(DVSS4) U$5.23(OVSS1) U$5.27(DVSS5) U$5.38(OVSS0) U$5.49(GND) U$6.5(VSSA_PLL) U$6.8(VSS_PLL) U$6.12(DVSS4) U$6.23(OVSS1) U$6.27(DVSS5) U$6.38(OVSS0) U$6.49(GND) U$7.5(VSSA_PLL) U$7.8(VSS_PLL) U$7.12(DVSS4) U$7.23(OVSS1) U$7.27(DVSS5) U$7.38(OVSS0) U$7.49(GND) U$8.5(VSSA_PLL) U$8.8(VSS_PLL) U$8.12(DVSS4) U$8.23(OVSS1) U$8.27(DVSS5) U$8.38(OVSS0) U$8.49(GND) U$9.5(VSSA_PLL) U$9.8(VSS_PLL) U$9.12(DVSS4) U$9.23(OVSS1) U$9.27(DVSS5) U$9.38(OVSS0) U$9.49(GND) U$10.5(VSSA_PLL) U$10.8(VSS_PLL) U$10.12(DVSS4) U$10.23(OVSS1) U$10.27(DVSS5) U$10.38(OVSS0) U$10.49(GND) U$11.4(G) U$12.4(G) U$13.4(G)
N$1: C_CLKOUT.TP U$1.43(CORE_CLOCKOUT)
N$2: C_CLKOUT5.TP U$6.43(CORE_CLOCKOUT)
N$3: C_CLKOUT1.TP U$2.43(CORE_CLOCKOUT)
N$4: C_CLKOUT2.TP U$3.43(CORE_CLOCKOUT)
N$5: C_CLKOUT3.TP U$4.43(CORE_CLOCKOUT)
N$6: C_CLKOUT4.TP U$5.43(CORE_CLOCKOUT)
N$7: C_CLKOUT9.TP U$10.43(CORE_CLOCKOUT)
N$8: C_CLKOUT8.TP U$9.43(CORE_CLOCKOUT)
N$9: C_CLKOUT7.TP U$8.43(CORE_CLOCKOUT)
N$10: C_CLKOUT6.TP U$7.43(CORE_CLOCKOUT)
N$41: THERMISTOR.2 X1.2
N$46: THERMISTOR.1 X1.1
REPORT_N: PL1.5 U$1.16(REPORT_N) U$2.16(REPORT_N) U$3.16(REPORT_N) U$4.16(REPORT_N) U$5.16(REPORT_N) U$6.16(REPORT_N) U$7.16(REPORT_N) U$8.16(REPORT_N) U$9.16(REPORT_N) U$10.16(REPORT_N)
REPORT_P: PL1.4 U$1.17(REPORT_P) U$2.17(REPORT_P) U$3.17(REPORT_P) U$4.17(REPORT_P) U$5.17(REPORT_P) U$6.17(REPORT_P) U$7.17(REPORT_P) U$8.17(REPORT_P) U$9.17(REPORT_P) U$10.17(REPORT_P)
RST: C12.1 C24.1 C36.1 C48.1 C60.1 C72.1 C84.1 C96.1 C108.1 C120.1 PL1.11 R2.1 R4.1 R6.1 R8.1 R10.1 R12.1 R14.1 R16.1 R18.1 R20.1 U$1.44(RSTN) U$2.44(RSTN) U$3.44(RSTN) U$4.44(RSTN) U$5.44(RSTN) U$6.44(RSTN) U$7.44(RSTN) U$8.44(RSTN) U$9.44(RSTN) U$10.44(RSTN)
VCC1V2: C1.2 C3.1 C4.1 C6.1 C7.1 C8.1 C10.1 C11.1 C13.2 C15.1 C16.1 C18.1 C19.1 C20.1 C22.1 C23.1 C25.2 C27.1 C28.1 C30.1 C31.1 C32.1 C34.1 C35.1 C37.2 C39.1 C40.1 C42.1 C43.1 C44.1 C46.1 C47.1 C49.2 C51.1 C52.1 C54.1 C55.1 C56.1 C58.1 C59.1 C61.2 C63.1 C64.1 C66.1 C67.1 C68.1 C70.1 C71.1 C73.2 C75.1 C76.1 C78.1 C79.1 C80.1 C82.1 C83.1 C85.2 C87.1 C88.1 C90.1 C91.1 C92.1 C94.1 C95.1 C97.2 C99.1 C100.1 C102.1 C103.1 C104.1 C106.1 C107.1 C109.2 C111.1 C112.1 C114.1 C115.1 C116.1 C118.1 C119.1 PL1.1 PL1.8 U$1.3(DVDD26) U$1.4(DVDD0) U$1.10(DVDD31) U$1.11(DVDD29) U$1.13(DVDD9) U$1.14(DVDD30) U$1.15(DVDD11) U$1.18(DVDD35) U$1.19(DVDD1) U$1.20(DVDD32) U$1.21(DVDD14) U$1.22(DVDD33) U$1.25(DVDD15) U$1.26(DVDD34) U$1.28(DVDD19) U$1.29(DVDD4) U$1.30(DVDD5) U$1.31(DVDD2) U$1.32(DVDD6) U$1.33(DVDD7) U$1.34(DVDD8) U$1.39(DVDD10) U$1.40(DVDD20) U$1.41(DVDD3) U$1.42(DVDD12) U$1.45(DVDD13) U$1.46(DVDD40) U$1.47(DVDD41) U$1.48(DVDD25) U$2.3(DVDD26) U$2.4(DVDD0) U$2.10(DVDD31) U$2.11(DVDD29) U$2.13(DVDD9) U$2.14(DVDD30) U$2.15(DVDD11) U$2.18(DVDD35) U$2.19(DVDD1) U$2.20(DVDD32) U$2.21(DVDD14) U$2.22(DVDD33) U$2.25(DVDD15) U$2.26(DVDD34) U$2.28(DVDD19) U$2.29(DVDD4) U$2.30(DVDD5) U$2.31(DVDD2) U$2.32(DVDD6) U$2.33(DVDD7) U$2.34(DVDD8) U$2.39(DVDD10) U$2.40(DVDD20) U$2.41(DVDD3) U$2.42(DVDD12) U$2.45(DVDD13) U$2.46(DVDD40) U$2.47(DVDD41) U$2.48(DVDD25) U$3.3(DVDD26) U$3.4(DVDD0) U$3.10(DVDD31) U$3.11(DVDD29) U$3.13(DVDD9) U$3.14(DVDD30) U$3.15(DVDD11) U$3.18(DVDD35) U$3.19(DVDD1) U$3.20(DVDD32) U$3.21(DVDD14) U$3.22(DVDD33) U$3.25(DVDD15) U$3.26(DVDD34) U$3.28(DVDD19) U$3.29(DVDD4) U$3.30(DVDD5) U$3.31(DVDD2) U$3.32(DVDD6) U$3.33(DVDD7) U$3.34(DVDD8) U$3.39(DVDD10) U$3.40(DVDD20) U$3.41(DVDD3) U$3.42(DVDD12) U$3.45(DVDD13) U$3.46(DVDD40) U$3.47(DVDD41) U$3.48(DVDD25) U$4.3(DVDD26) U$4.4(DVDD0) U$4.10(DVDD31) U$4.11(DVDD29) U$4.13(DVDD9) U$4.14(DVDD30) U$4.15(DVDD11) U$4.18(DVDD35) U$4.19(DVDD1) U$4.20(DVDD32) U$4.21(DVDD14) U$4.22(DVDD33) U$4.25(DVDD15) U$4.26(DVDD34) U$4.28(DVDD19) U$4.29(DVDD4) U$4.30(DVDD5) U$4.31(DVDD2) U$4.32(DVDD6) U$4.33(DVDD7) U$4.34(DVDD8) U$4.39(DVDD10) U$4.40(DVDD20) U$4.41(DVDD3) U$4.42(DVDD12) U$4.45(DVDD13) U$4.46(DVDD40) U$4.47(DVDD41) U$4.48(DVDD25) U$5.3(DVDD26) U$5.4(DVDD0) U$5.10(DVDD31) U$5.11(DVDD29) U$5.13(DVDD9) U$5.14(DVDD30) U$5.15(DVDD11) U$5.18(DVDD35) U$5.19(DVDD1) U$5.20(DVDD32) U$5.21(DVDD14) U$5.22(DVDD33) U$5.25(DVDD15) U$5.26(DVDD34) U$5.28(DVDD19) U$5.29(DVDD4) U$5.30(DVDD5) U$5.31(DVDD2) U$5.32(DVDD6) U$5.33(DVDD7) U$5.34(DVDD8) U$5.39(DVDD10) U$5.40(DVDD20) U$5.41(DVDD3) U$5.42(DVDD12) U$5.45(DVDD13) U$5.46(DVDD40) U$5.47(DVDD41) U$5.48(DVDD25) U$6.3(DVDD26) U$6.4(DVDD0) U$6.10(DVDD31) U$6.11(DVDD29) U$6.13(DVDD9) U$6.14(DVDD30) U$6.15(DVDD11) U$6.18(DVDD35) U$6.19(DVDD1) U$6.20(DVDD32) U$6.21(DVDD14) U$6.22(DVDD33) U$6.25(DVDD15) U$6.26(DVDD34) U$6.28(DVDD19) U$6.29(DVDD4) U$6.30(DVDD5) U$6.31(DVDD2) U$6.32(DVDD6) U$6.33(DVDD7) U$6.34(DVDD8) U$6.39(DVDD10) U$6.40(DVDD20) U$6.41(DVDD3) U$6.42(DVDD12) U$6.45(DVDD13) U$6.46(DVDD40) U$6.47(DVDD41) U$6.48(DVDD25) U$7.3(DVDD26) U$7.4(DVDD0) U$7.10(DVDD31) U$7.11(DVDD29) U$7.13(DVDD9) U$7.14(DVDD30) U$7.15(DVDD11) U$7.18(DVDD35) U$7.19(DVDD1) U$7.20(DVDD32) U$7.21(DVDD14) U$7.22(DVDD33) U$7.25(DVDD15) U$7.26(DVDD34) U$7.28(DVDD19) U$7.29(DVDD4) U$7.30(DVDD5) U$7.31(DVDD2) U$7.32(DVDD6) U$7.33(DVDD7) U$7.34(DVDD8) U$7.39(DVDD10) U$7.40(DVDD20) U$7.41(DVDD3) U$7.42(DVDD12) U$7.45(DVDD13) U$7.46(DVDD40) U$7.47(DVDD41) U$7.48(DVDD25) U$8.3(DVDD26) U$8.4(DVDD0) U$8.10(DVDD31) U$8.11(DVDD29) U$8.13(DVDD9) U$8.14(DVDD30) U$8.15(DVDD11) U$8.18(DVDD35) U$8.19(DVDD1) U$8.20(DVDD32) U$8.21(DVDD14) U$8.22(DVDD33) U$8.25(DVDD15) U$8.26(DVDD34) U$8.28(DVDD19) U$8.29(DVDD4) U$8.30(DVDD5) U$8.31(DVDD2) U$8.32(DVDD6) U$8.33(DVDD7) U$8.34(DVDD8) U$8.39(DVDD10) U$8.40(DVDD20) U$8.41(DVDD3) U$8.42(DVDD12) U$8.45(DVDD13) U$8.46(DVDD40) U$8.47(DVDD41) U$8.48(DVDD25) U$9.3(DVDD26) U$9.4(DVDD0) U$9.10(DVDD31) U$9.11(DVDD29) U$9.13(DVDD9) U$9.14(DVDD30) U$9.15(DVDD11) U$9.18(DVDD35) U$9.19(DVDD1) U$9.20(DVDD32) U$9.21(DVDD14) U$9.22(DVDD33) U$9.25(DVDD15) U$9.26(DVDD34) U$9.28(DVDD19) U$9.29(DVDD4) U$9.30(DVDD5) U$9.31(DVDD2) U$9.32(DVDD6) U$9.33(DVDD7) U$9.34(DVDD8) U$9.39(DVDD10) U$9.40(DVDD20) U$9.41(DVDD3) U$9.42(DVDD12) U$9.45(DVDD13) U$9.46(DVDD40) U$9.47(DVDD41) U$9.48(DVDD25) U$10.3(DVDD26) U$10.4(DVDD0) U$10.10(DVDD31) U$10.11(DVDD29) U$10.13(DVDD9) U$10.14(DVDD30) U$10.15(DVDD11) U$10.18(DVDD35) U$10.19(DVDD1) U$10.20(DVDD32) U$10.21(DVDD14) U$10.22(DVDD33) U$10.25(DVDD15) U$10.26(DVDD34) U$10.28(DVDD19) U$10.29(DVDD4) U$10.30(DVDD5) U$10.31(DVDD2) U$10.32(DVDD6) U$10.33(DVDD7) U$10.34(DVDD8) U$10.39(DVDD10) U$10.40(DVDD20) U$10.41(DVDD3) U$10.42(DVDD12) U$10.45(DVDD13) U$10.46(DVDD40) U$10.47(DVDD41) U$10.48(DVDD25)

## Notes on the sheet
- VCC1V2
- CLK
- AVCC3V3 | AVCC3V3
- AVCC3V3 | AVCC3V3 | AVCC3V3
- REPORT_P
- RST | RST
- REPORT_N | RST | RST | RST
- VCC1V2 | VCC1V2 | VCC1V2 | VCC1V2 | VCC1V2 | VCC1V2 | VCC1V2 | VCC1V2 | VCC1V2 | VCC1V2 | VCC1V2 | VCC1V2
- CONFIG_P | AVCC3V3 | VCC1V2 | VCC1V2 | VCC1V2 | VCC1V2 | VCC1V2 | VCC1V2 | VCC1V2 | VCC1V2 | VCC1V2 | VCC1V2 | VCC1V2 | VCC1V2 | VCC1V2 | VCC1V2 | VCC1V2 | VCC1V2 | VCC1V2 | VCC1V2 | AVCC3V3
- AVCC3V3 | AVCC3V3 | AVCC3V3
- CONFIG_N
- CONFIG_P | CONFIG_P1 | CONFIG_P4 | CONFIG_P5
- VCC1V2 | CONFIG_P1 | CONFIG_P2 | CONFIG_P2 | CONFIG_P3 | CONFIG_P3 | CONFIG_P4
- CONFIG_N | CONFIG_N1 | CONFIG_N4 | CONFIG_N5
- CONFIG_P10 | CONFIG_N1 | CONFIG_N2 | CONFIG_N2 | CONFIG_N3 | CONFIG_N3 | CONFIG_N4
- VCC1V2 | VCC1V2 | VCC1V2 | VCC1V2
- CONFIG_N10 | VCC1V2 | VCC1V2 | VCC1V2 | VCC1V2 | VCC1V2 | VCC1V2
- VCC1V2 | VCC1V2 | VCC1V2 | VCC1V2
- RST | VCC1V2 | VCC1V2 | VCC1V2 | VCC1V2 | VCC1V2 | VCC1V2
- AVCC1V2
- VCC1V2 | VCC1V2
- AVCC3V3 | VCC1V2 | VCC1V2 | VCC1V2
- AVCC1V2 | AVCC1V2
- AVCC1V2 | AVCC1V2 | AVCC1V2
- CLK1 | VCC1V2 | CLK5 | VCC1V2
- CLK2 | VCC1V2 | CLK3 | VCC1V2 | CLK4 | VCC1V2
- VCC1V2 | VCC1V2 | VCC1V2 | VCC1V2
- VCC1V2 | VCC1V2 | VCC1V2 | VCC1V2 | VCC1V2 | VCC1V2
- VCC1V2 | VCC1V2
- VCC1V2 | VCC1V2 | VCC1V2
- VCC1V2 | VCC1V2 | VCC1V2 | REPORT_N | REPORT_P | VCC1V2 | VCC1V2 | VCC1V2 | AVCC3V3 | VCC1V2 | VCC1V2 | VCC1V2 | REPORT_N | REPORT_P | VCC1V2 | VCC1V2 | VCC1V2 | AVCC3V3
- VCC1V2 | VCC1V2 | VCC1V2 | REPORT_N | REPORT_P | VCC1V2 | VCC1V2 | VCC1V2 | AVCC3V3 | VCC1V2 | VCC1V2 | VCC1V2 | REPORT_N | REPORT_P | VCC1V2 | VCC1V2 | VCC1V2 | AVCC3V3 | VCC1V2 | VCC1V2 | VCC1V2 | REPORT_N | REPORT_P | VCC1V2 | VCC1V2 | VCC1V2 | AVCC3V3
- AVCC3V3 | AVCC3V3
- AVCC3V3 | AVCC3V3 | AVCC3V3
- RST | RST
- RST | RST | RST
- VCC1V2 | VCC1V2 | VCC1V2 | VCC1V2 | VCC1V2 | VCC1V2 | VCC1V2 | VCC1V2 | VCC1V2 | VCC1V2 | VCC1V2 | VCC1V2
- AVCC3V3 | VCC1V2 | VCC1V2 | VCC1V2 | VCC1V2 | VCC1V2 | VCC1V2 | VCC1V2 | VCC1V2 | VCC1V2 | VCC1V2 | VCC1V2 | VCC1V2 | VCC1V2 | VCC1V2 | VCC1V2 | VCC1V2 | VCC1V2 | VCC1V2 | AVCC3V3
- AVCC3V3 | AVCC3V3 | AVCC3V3
- CONFIG_P5 | CONFIG_P6 | CONFIG_P9 | CONFIG_P10
- CONFIG_P6 | CONFIG_P7 | CONFIG_P7 | CONFIG_P8 | CONFIG_P8 | CONFIG_P9
- CONFIG_N5 | CONFIG_N6 | CONFIG_N9 | CONFIG_N10
- CONFIG_N6 | CONFIG_N7 | CONFIG_N7 | CONFIG_N8 | CONFIG_N8 | CONFIG_N9
- VCC1V2 | VCC1V2 | VCC1V2 | VCC1V2
- VCC1V2 | VCC1V2 | VCC1V2 | VCC1V2 | VCC1V2 | VCC1V2
- VCC1V2 | VCC1V2 | VCC1V2 | VCC1V2
- VCC1V2 | VCC1V2 | VCC1V2 | VCC1V2 | VCC1V2 | VCC1V2
- VCC1V2 | VCC1V2
- VCC1V2 | VCC1V2 | VCC1V2
- AVCC1V2 | AVCC1V2
- AVCC1V2 | AVCC1V2 | AVCC1V2
- CLK6 | VCC1V2 | CLK10 | VCC1V2
- CLK7 | VCC1V2 | CLK8 | VCC1V2 | CLK9 | VCC1V2
- VCC1V2 | VCC1V2 | VCC1V2 | VCC1V2
- VCC1V2 | VCC1V2 | VCC1V2 | VCC1V2 | VCC1V2 | VCC1V2
- VCC1V2 | VCC1V2
- VCC1V2 | VCC1V2 | VCC1V2
- VCC1V2 | VCC1V2 | VCC1V2 | REPORT_N | REPORT_P | VCC1V2 | VCC1V2 | VCC1V2 | AVCC3V3 | VCC1V2 | VCC1V2 | VCC1V2 | REPORT_N | REPORT_P | VCC1V2 | VCC1V2 | VCC1V2 | AVCC3V3
- VCC1V2 | VCC1V2 | VCC1V2 | REPORT_N | REPORT_P | VCC1V2 | VCC1V2 | VCC1V2 | AVCC3V3 | VCC1V2 | VCC1V2 | VCC1V2 | REPORT_N | REPORT_P | VCC1V2 | VCC1V2 | VCC1V2 | AVCC3V3 | VCC1V2 | VCC1V2 | VCC1V2 | REPORT_N | REPORT_P | VCC1V2 | VCC1V2 | VCC1V2 | AVCC3V3
- AVCC3V3 | CLK_IO1 | AVCC3V3 | CLK_IO2 | AVCC3V3 | CLK
- CLK6 | CLK2 | CLK9 | CLK5 | CLK_IO2 | CLK3
- CLK7 | CLK1 | CLK10 | CLK4 | CLK_IO1 | CLK8
- FIX: CORE_VOLTAGE 0.9V NOT 1.2V
- FIX: PLL_VOLTAGE 1V NOT 1.2V
- BUG ONLY IN DESCRIPTION ARDUINO SHIELD WITH CORRECT VOLTAGE
- Designer: Michal Maslik
- CC BY-NC-SA 3.0

## Library data of the parts
C1-C120 = rcl:C-EU: CAPACITOR, European symbol
C_CLKOUT C_CLKOUT1-C_CLKOUT9 = testpad:PTR1: TEST PIN
PL1 = con-molex-2:555X-14: Mini FIT connector 14 way
R1-R20 THERMISTOR = rcl:R-EU_: RESISTOR, European symbol
U$1-U$10 = Avalon-A3255:A3255Q48: AVALON ASIC CHIP FOR BITCOIN MINER
U$11-U$13 = SparkFun2:MOSFET-NCHANNEL-SOIC8: N-Channel MOSFET IRF9410 and NDS8434 are common, SOIC-8 parts.
X1 = con-garry:332-02: 2 Pin - 2mm Dual Row Source: www.mpe-connector.de / garry_shortform_2012.pdf